# Altium project battery_protect.PrjPcb
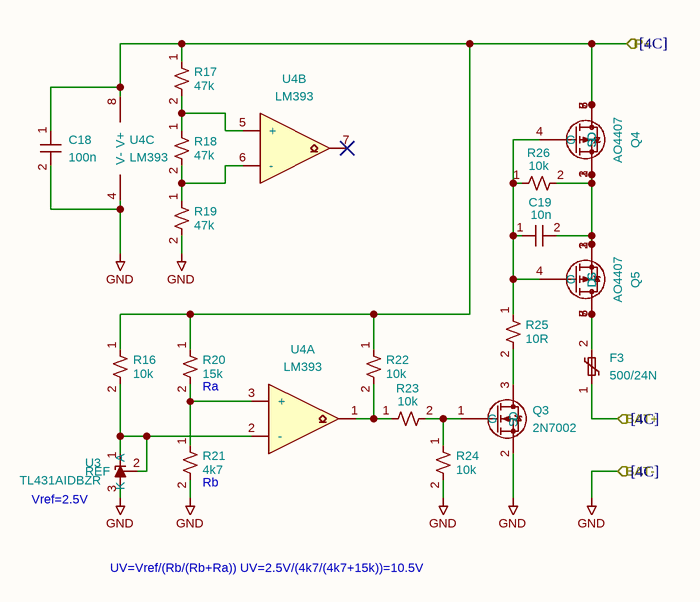
[diagram p0: battery_protect.SchDoc]
6 sheets, 69 parts. Net scope: flat (ports and power ports of the same name join across sheets).
Board files: ups_lead_acid_electgpl_v1.0.PcbDoc, ups_lead_acid_electgpl_v1.0(1).PcbDoc
Sheets:
  battery_protect.SchDoc
  buck.SchDoc
  bypass.SchDoc
  charge.SchDoc
  input_protect.SchDoc
  voltmeter.SchDoc

## Sheet battery_protect.SchDoc
size 297 x 209 mm

### Parts
C18  100n  [C_0603_1608Metric]
C19  10n  [C_0603_1608Metric]
F3  500/24N  [Fuse_2920_7451Metric]
Q3  2N7002  [SOT-23]
Q4  AO4407  [SOP-8_3.9x4.9mm_P1.27mm]
Q5  AO4407  [SOP-8_3.9x4.9mm_P1.27mm]
R16  10k  [R_0603_1608Metric]
R17  47k  [R_0603_1608Metric]
R18  47k  [R_0603_1608Metric]
R19  47k  [R_0603_1608Metric]
R20  15k  [R_0603_1608Metric]
R21  4k7  [R_0603_1608Metric]
R22  10k  [R_0603_1608Metric]
R23  10k  [R_0603_1608Metric]
R24  10k  [R_0603_1608Metric]
R25  10R  [R_0603_1608Metric]
R26  10k  [R_0603_1608Metric]
U3  TL431AIDBZR  [SOT-23]
U4  LM393  [SOIC-8_3.9x4.9mm_P1.27mm]  (parts A,B,C of 3)

### Ports
BAT+ (in, see [4C]), BAT- (in, see [4C]), P+ (in, see [4C])

### Nets
GND: C18.2 Q3.2(S) R19.2 R21.2 R24.2 U3.3(A) U4.4(V-) ; port BAT-
BAT+: F3.1 ; port BAT+
P+: C18.1 Q4.5(D) Q4.6(D) Q4.7(D) Q4.8(D) R16.1 R17.1 R20.1 R22.1 U4.8(V+) ; port P+
NetC19_1: C19.1 Q4.4(G) Q5.4(G) R25.1 R26.1
NetC19_2: C19.2 Q4.1(S) Q4.2(S) Q4.3(S) Q5.1(S) Q5.2(S) Q5.3(S) R26.2
NetF3_2: F3.2 Q5.5(D) Q5.6(D) Q5.7(D) Q5.8(D)
NetQ3_1: Q3.1(G) R23.2 R24.1
NetQ3_3: Q3.3(D) R25.2
NetR16_2: R16.2 U3.1(K) U3.2(REF) U4.2(-)
NetR17_2: R17.2 R18.1 U4.5(+)
NetR18_2: R18.2 R19.1 U4.6(-)
NetR20_2: R20.2 R21.1 U4.3(+)
NetR22_2: R22.2 R23.1 U4.1

Not connected (* = marked no-connect by the designer): U4 7*

### Notes on the sheet
- (near R20) Ra
- (near R21) Rb
- (near U3) Vref=2.5V
- UV=Vref/(Rb/(Rb+Ra))
  UV=2.5V/(4k7/(4k7+15k))=10.5V
- 1
- 2
- 3
- 4
- 5
- 6
- A
- B
- C
- D
- Title: UPS Lead Acid
- File: battery_protect.kicad_sch
- Sheet: /
- Electgpl
- KiCad E.D.A.  kicad (5.1.4)-1
- Size: A4
- Date: 2025-06-05
- Rev: 1.0
- Id: 1/1

### Library data of the parts
C18 = C_Small: MFR P/N: CL10B104KB8NNNC; LCSC: C1591; Value: 100n; Footprint: Capacitor_SMD:C_0603_1608Metric
C19 = C_Small: MFR P/N: CL10B103KB8NNNC; LCSC: C1589; Value: 10n; Footprint: Capacitor_SMD:C_0603_1608Metric
F3 = Polyfuse_Small: MFR P/N: SMD2920-500/24N; Absolute minimum: 16V 3A; Reference MFG P/N: C6165172; LCSC: C6165172; Value: 500/24N; Footprint: Fuse:Fuse_2920_7451Metric
Q3 = 2N7002: MFR P/N: 2N7002,215; LCSC: C65189; Value: 2N7002; Footprint: Package_TO_SOT_SMD:SOT-23
Q4 Q5 = IRF7404: MFR P/N: AO4407A; LCSC: C2841482; Value: AO4407; Footprint: Package_SO:SOP-8_3.9x4.9mm_P1.27mm
R16 R22-R24 R26 = R_Small_US: MFR P/N: FRC0603J103 TS; LCSC: C2930027; Value: 10k; Footprint: Resistor_SMD:R_0603_1608Metric
R17-R19 = R_Small_US: MFR P/N: FRC0603F4702TS; LCSC: C2907042; Value: 47k; Footprint: Resistor_SMD:R_0603_1608Metric
R20 = R_Small_US: MFR P/N: FRC0603F1502TS; LCSC: C2906995; Value: 15k; Footprint: Resistor_SMD:R_0603_1608Metric
R21 = R_Small_US: MFR P/N: FRC0603J472 TS; LCSC: C2907166; Value: 4k7; Footprint: Resistor_SMD:R_0603_1608Metric
R25 = R_Small_US: MFR P/N: FRC0603J100 TS; LCSC: C2907091; Value: 10R; Footprint: Resistor_SMD:R_0603_1608Metric
U3 = TL431DBZ: LCSC: C23892; MFR P/N: TL431AIDBZR; Value: TL431AIDBZR; Footprint: Package_TO_SOT_SMD:SOT-23
U4 = LM393: MFR P/N: LM393DR; LCSC: C67470; Value: LM393; Footprint: Package_SO:SOIC-8_3.9x4.9mm_P1.27mm

## Sheet buck.SchDoc
size 297 x 209 mm
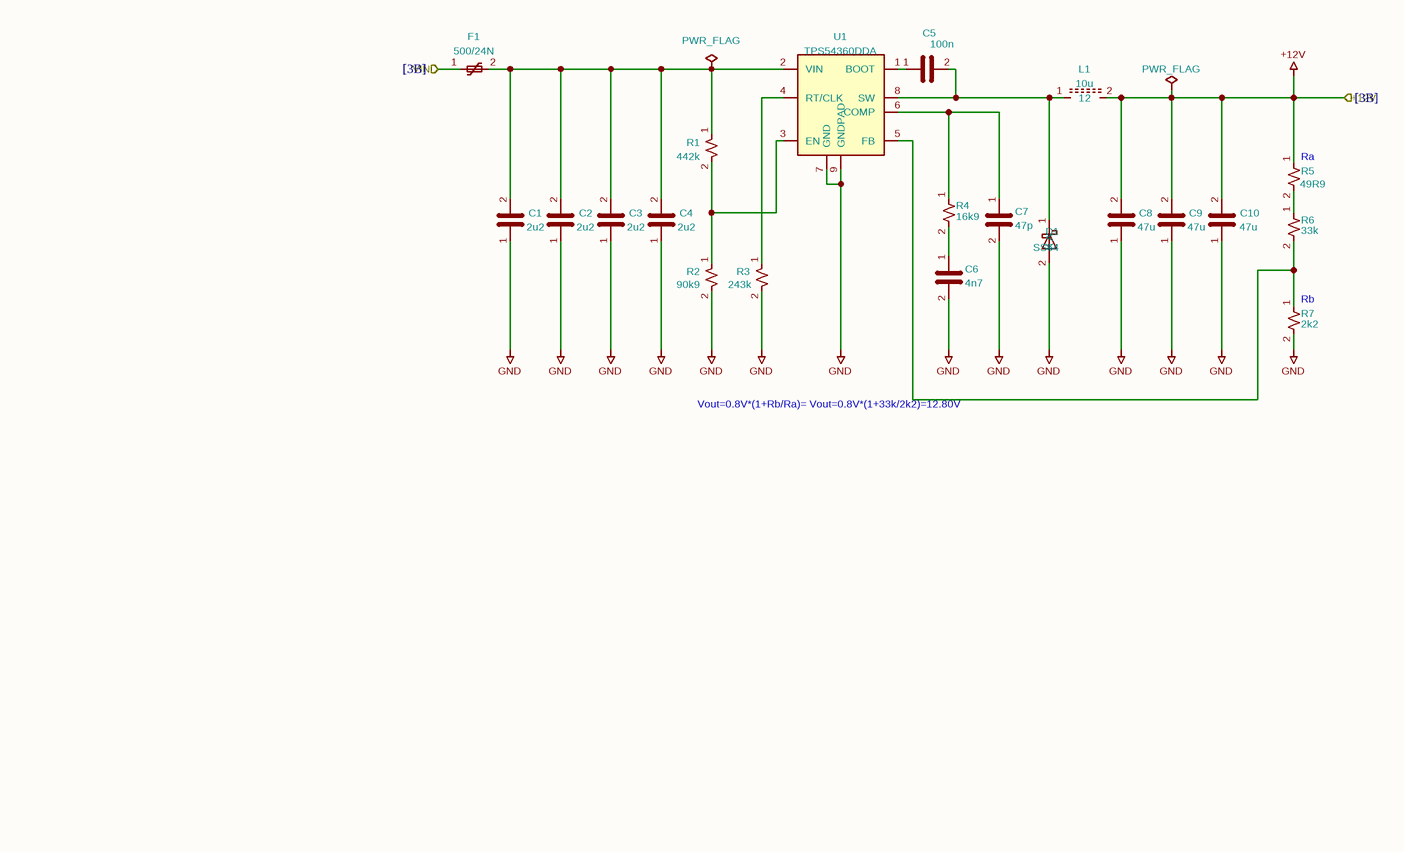
[diagram p1: buck.SchDoc]

### Parts
#FLG01  PWR_FLAG  (graphical)
#FLG02  PWR_FLAG  (graphical)
C1  2u2  [C_0603_1608Metric]
C2  2u2  [C_0603_1608Metric]
C3  2u2  [C_0603_1608Metric]
C4  2u2  [C_0603_1608Metric]
C5  100n  [C_0603_1608Metric]
C6  4n7  [C_0603_1608Metric]
C7  47p  [C_0603_1608Metric]
C8  47u  [C_0805_2012Metric]
C9  47u  [C_0805_2012Metric]
C10  47u  [C_0805_2012Metric]
D1  SS54  [D_SMC]
F1  500/24N  [Fuse_2920_7451Metric]
L1  10u  [L_Taiyo-Yuden_NR-60xx]
R1  442k  [R_0603_1608Metric]
R2  90k9  [R_0603_1608Metric]
R3  243k  [R_0603_1608Metric]
R4  16k9  [R_0603_1608Metric]
R5  49R9  [R_0603_1608Metric]
R6  33k  [R_0603_1608Metric]
R7  2k2  [R_0603_1608Metric]
U1  TPS54360DDA  [HSOP-8-1EP_3.9x4.9mm_P1.27mm_EP2.41x3.1mm_ThermalVias]

### Ports
+12V (in, see [3B]), VIN (in, see [3B])

### Nets
+12V: #FLG02.1 C8.2 C9.2 C10.2 L1.2 R5.1 ; port +12V
GND: C1.1 C2.1 C3.1 C4.1 C6.2 C7.2 C8.1 C9.1 C10.1 D1.2(A) R2.2 R3.2 R7.2 U1.7(GND) U1.9(GNDPAD)
VIN: F1.1 ; port VIN
Net#FLG01_1: #FLG01.1 C1.2 C2.2 C3.2 C4.2 F1.2 R1.1 U1.2(VIN)
NetC5_1: C5.1 U1.1(BOOT)
NetC5_2: C5.2 D1.1(K) L1.1 U1.8(SW)
NetC6_1: C6.1 R4.2
NetC7_1: C7.1 R4.1 U1.6(COMP)
NetR1_2: R1.2 R2.1 U1.3(EN)
NetR3_1: R3.1 U1.4(RT/CLK)
NetR5_2: R5.2 R6.1
NetR6_2: R6.2 R7.1 U1.5(FB)

### Notes on the sheet
- (near R5) Ra
- (near R7) Rb
- Vout=0.8V*(1+Rb/Ra)=
  Vout=0.8V*(1+33k/2k2)=12.80V
- 1
- 2
- 3
- 4
- 5
- 6
- A
- B
- C
- D
- Title: UPS Lead Acid
- File: buck.kicad_sch
- Sheet: /
- Electgpl
- KiCad E.D.A.  kicad (5.1.4)-1
- Size: A4
- Date: 2025-06-05
- Rev: 1.0
- Id: 1/1

### Library data of the parts
C1-C4 = C: MFR P/N: CL10A225KB8NNNC; Absolute minimum: 100V; Reference MFG P/N: C6119935; LCSC: C913904; Value: 2u2; Footprint: Capacitor_SMD:C_0603_1608Metric
C5 = C: MFR P/N: CL10B104KB8NNNC; Absolute minimum: 50V; Reference MFG P/N: C5142567; LCSC: C1591; Value: 100n; Footprint: Capacitor_SMD:C_0603_1608Metric
C6 = C: MFR P/N: CL10B472KB8NNNC; Absolute minimum: 50V; Reference MFG P/N: C7503510; LCSC: C1621; Value: 4n7; Footprint: Capacitor_SMD:C_0603_1608Metric
C7 = C: MFR P/N: CL10C470JB8NNNC; Absolute minimum: 50V; Reference MFG P/N: C466230; LCSC: C1671; Value: 47p; Footprint: Capacitor_SMD:C_0603_1608Metric
C8-C10 = C: MFR P/N: CL21A226MAYNNNE; Absolute minimum: 10V; Reference MFG P/N: C19103846; LCSC: C602037; Value: 47u; Footprint: Capacitor_SMD:C_0805_2012Metric
D1 = B240: Absolute minimum: 40V 5A; Reference MFG P/N: C5200096; LCSC: C5199108; MFR P/N: SS54; Value: SS54; Footprint: Diode_SMD:D_SMC
F1 = Polyfuse_Small: as F3 on sheet battery_protect; LCSC: C6165172; Value: 500/24N; Footprint: Fuse:Fuse_2920_7451Metric
L1 = L_Ferrite: MFR P/N: VLS6045EX-100M; Absolute minimum: 5A; Reference MFG P/N: C2849537; LCSC: C360734; Value: 10u; Footprint: Inductor_SMD:L_Taiyo-Yuden_NR-60xx
R1 = R_Small_US: MFR P/N: 0603WAF4423T5E; Absolute minimum: 442k 0402; Reference MFG P/N: C3016035; LCSC: C23175; Value: 442k; Footprint: Resistor_SMD:R_0603_1608Metric
R2 = R_Small_US: MFR P/N: FRC0603F9092TS; Absolute minimum: 90k9 0402; Reference MFG P/N: C26989; LCSC: C2930136; Value: 90k9; Footprint: Resistor_SMD:R_0603_1608Metric
R3 = R_Small_US: MFR P/N: FRC0603F2433TS; Absolute minimum: 243k 0402; Reference MFG P/N: C2998149; LCSC: C7467321; Value: 243k; Footprint: Resistor_SMD:R_0603_1608Metric
R4 = R_Small_US: MFR P/N: FRC0603F1692TS; Absolute minimum: 16k9 0402; Reference MFG P/N: C2929989; LCSC: C2933158; Value: 16k9; Footprint: Resistor_SMD:R_0603_1608Metric
R5 = R_Small_US: MFR P/N: FRC0603F49R9TS; Absolute minimum: 49R9 0402; Reference MFG P/N: C25120; LCSC: C2930110; Value: 49R9; Footprint: Resistor_SMD:R_0603_1608Metric
R6 = R_Small_US: MFR P/N: FRC0603J333 TS; Absolute minimum: 53k6 0402; Reference MFG P/N: C5153961; LCSC: C2907153; Value: 33k; Footprint: Resistor_SMD:R_0603_1608Metric
R7 = R_Small_US: MFR P/N: FRC0603J222 TS; Absolute minimum: 10k2 0402; Reference MFG P/N: C3015976; LCSC: C2907117; Value: 2k2; Footprint: Resistor_SMD:R_0603_1608Metric
U1 = TPS54360DDA: MFR P/N: TPS54360DDAR; Reference MFG P/N: C44377; Absolute minimum: TPS54360DDA; LCSC: C44377; Value: TPS54360DDA; Footprint: Package_SO:HSOP-8-1EP_3.9x4.9mm_P1.27mm_EP2.41x3.1mm_ThermalVias
#FLG01 #FLG02 = PWR_FLAG: Value: PWR_FLAG

## Sheet bypass.SchDoc
size 297 x 209 mm
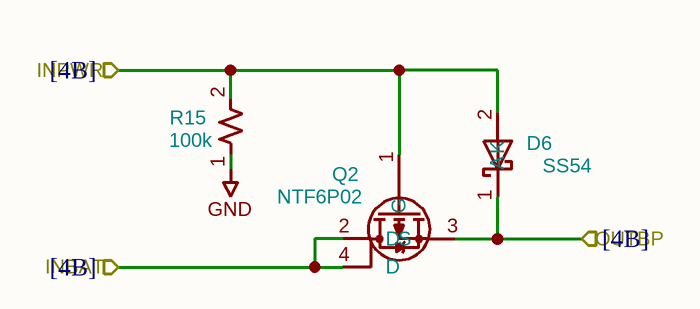
[diagram p2: bypass.SchDoc]

### Parts
D6  SS54  [D_SMC]
Q2  NTF6P02  [SOT-223-3_TabPin2]
R15  100k  [R_0603_1608Metric]

### Ports
INBAT (in, see [4B]), INPWR (in, see [4B]), OUTBP (in, see [4B])

### Nets
GND: R15.1
INBAT: Q2.2(D) Q2.4(D) ; port INBAT
INPWR: D6.2(A) Q2.1(G) R15.2 ; port INPWR
OUTBP: D6.1(K) Q2.3(S) ; port OUTBP

### Notes on the sheet
- 1
- 2
- 3
- 4
- 5
- 6
- A
- B
- C
- D
- Title: UPS Lead Acid
- File: bypass.kicad_sch
- Sheet: /
- Electgpl
- KiCad E.D.A.  kicad (5.1.4)-1
- Size: A4
- Date: 2025-06-05
- Rev: 1.0
- Id: 1/1

### Library data of the parts
D6 = B240: as D1 on sheet buck; LCSC: C5199108; MFR P/N: SS54; Value: SS54; Footprint: Diode_SMD:D_SMC
Q2 = Q_PMOS_GDSD: MFR P/N: NTF6P02T3G-VB; LCSC Part: C154901; LCSC: C558214; Value: NTF6P02; Footprint: Package_TO_SOT_SMD:SOT-223-3_TabPin2
R15 = R_Small_US: MFR P/N: FRC0603J104 TS; LCSC Part: C99198; LCSC: C2907088; Value: 100k; Footprint: Resistor_SMD:R_0603_1608Metric

## Sheet charge.SchDoc
size 297 x 209 mm
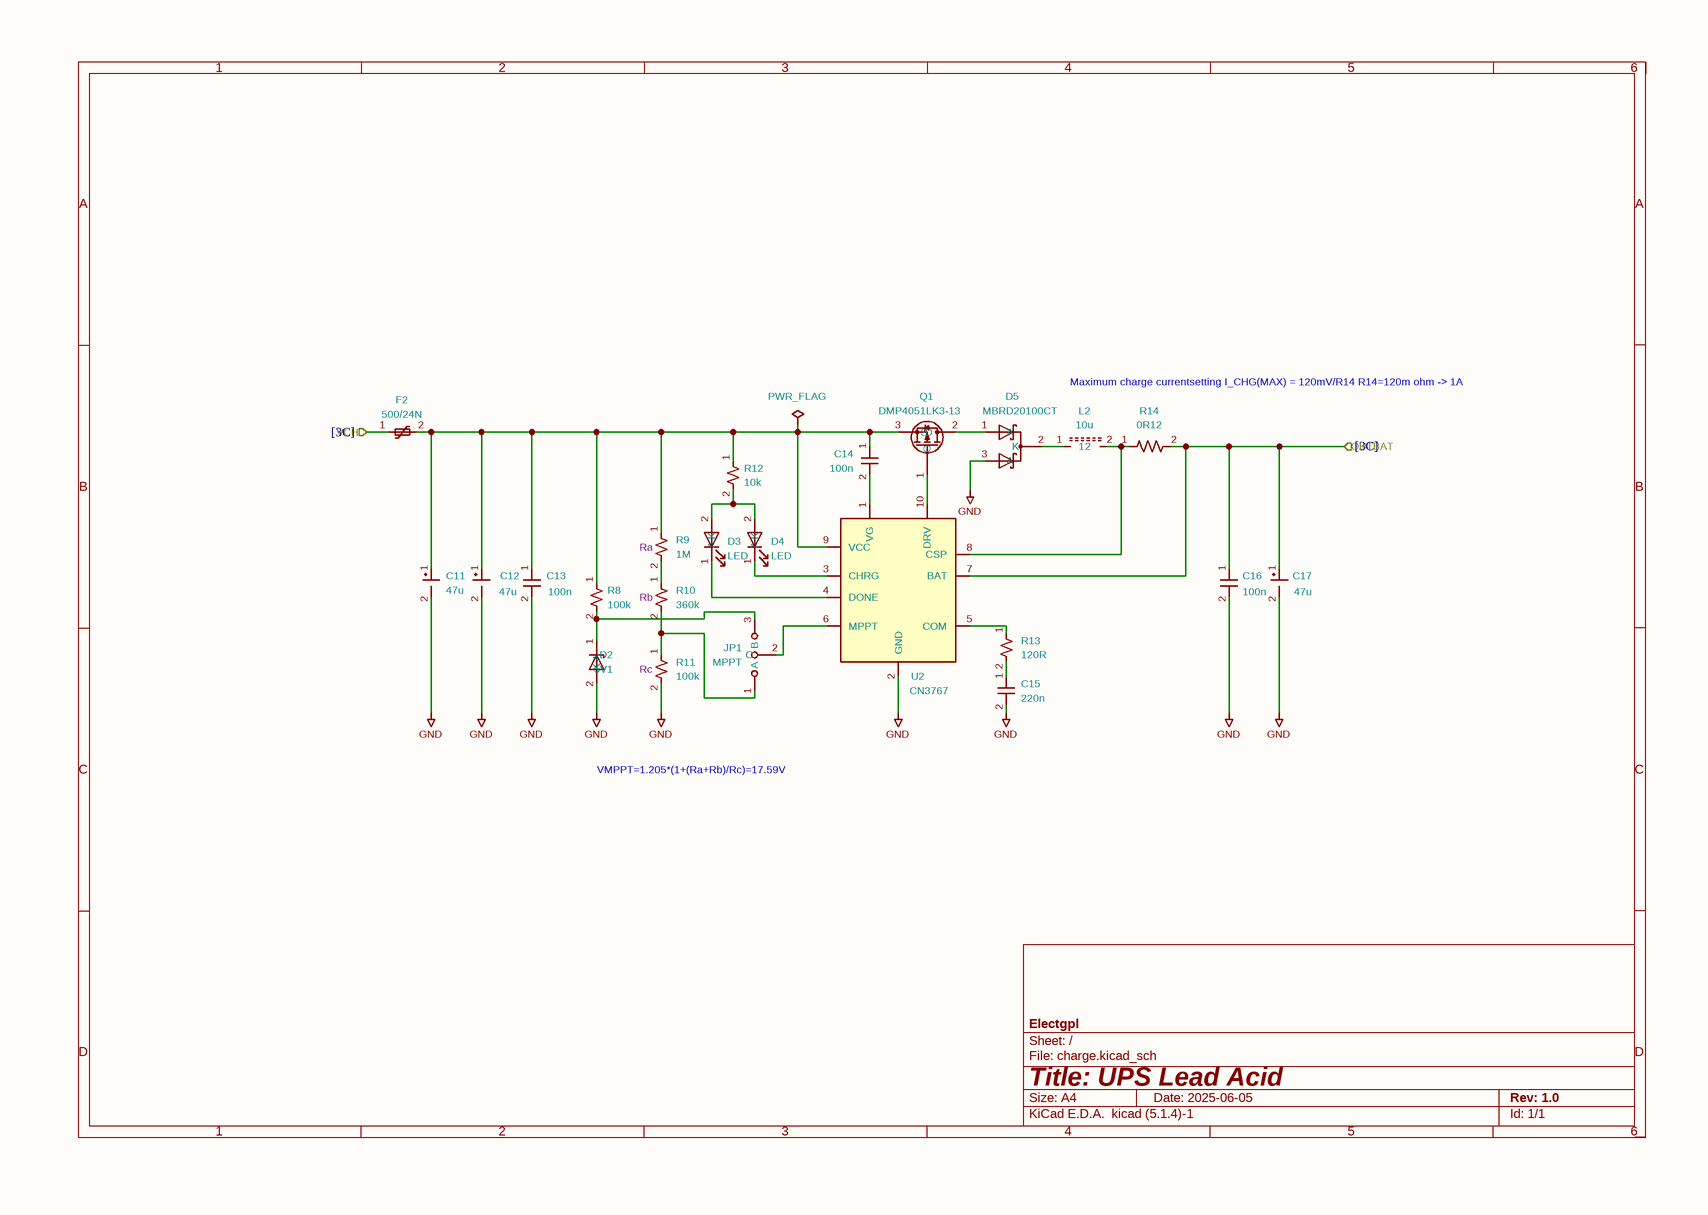
[diagram p3: charge.SchDoc]

### Parts
#FLG03  PWR_FLAG  (graphical)
C11  47u  [C_0805_2012Metric]
C12  47u  [C_0805_2012Metric]
C13  100n  [C_0603_1608Metric]
C14  100n  [C_0603_1608Metric]
C15  220n  [C_0603_1608Metric]
C16  100n  [C_0603_1608Metric]
C17  47u  [C_0805_2012Metric]
D2  5V1  [D_SOD-123]
D3  LED  [LED_0603_1608Metric]
D4  LED  [LED_0603_1608Metric]
D5  MBRD20100CT  [TO-252-2]
F2  500/24N  [Fuse_2920_7451Metric]
JP1  MPPT  [SolderJumper-3_P1.3mm_Open_Pad1.0x1.5mm]
L2  10u  [L_Taiyo-Yuden_NR-60xx]
Q1  DMP4051LK3-13  [TO-252-2]
R8  100k  [R_0603_1608Metric]
R9  Aux: Ra  [R_0603_1608Metric]  (hidden comment: 1M)
R10  Aux: Rb  [R_0603_1608Metric]  (hidden comment: 360k)
R11  Aux: Rc  [R_0603_1608Metric]  (hidden comment: 100k)
R12  10k  [R_0603_1608Metric]
R13  120R  [R_0603_1608Metric]
R14  0R12  [R_2512_6332Metric]
U2  CN3767  [SSOP-10_3.9x4.9mm_P1.00mm]

### Ports
OUTBAT (in, see [3C]), VCH (in, see [3C])

### Nets
GND: C11.2 C12.2 C13.2 C15.2 C16.2 C17.2 D2.2(A) D5.3(A) R11.2 U2.2(GND)
OUTBAT: C16.1 C17.1 R14.2 U2.7(BAT) ; port OUTBAT
VCH: F2.1 ; port VCH
Net#FLG03_1: #FLG03.1 C11.1 C12.1 C13.1 C14.1 F2.2 Q1.3(S) R8.1 R9.1 R12.1 U2.9(VCC)
NetC14_2: C14.2 U2.1(VG)
NetC15_1: C15.1 R13.2
NetD2_1: D2.1(K) JP1.3(B) R8.2
NetD3_1: D3.1(K) U2.4(DONE)
NetD3_2: D3.2(A) D4.2(A) R12.2
NetD4_1: D4.1(K) U2.3(CHRG)
NetD5_1: D5.1(A) Q1.2(D)
NetD5_2: D5.2(K) L2.1
NetJP1_1: JP1.1(A) R10.2 R11.1
NetJP1_2: JP1.2(C) U2.6(MPPT)
NetL2_2: L2.2 R14.1 U2.8(CSP)
NetQ1_1: Q1.1(G) U2.10(DRV)
NetR9_2: R9.2 R10.1
NetR13_1: R13.1 U2.5(COM)

### Notes on the sheet
- Maximum charge currentsetting
  I_CHG(MAX) = 120mV/R14
  R14=120m ohm -> 1A
- VMPPT=1.205*(1+(Ra+Rb)/Rc)=17.59V
- 1
- 2
- 3
- 4
- 5
- 6
- A
- B
- C
- D
- Title: UPS Lead Acid
- File: charge.kicad_sch
- Sheet: /
- Electgpl
- KiCad E.D.A.  kicad (5.1.4)-1
- Size: A4
- Date: 2025-06-05
- Rev: 1.0
- Id: 1/1

### Library data of the parts
C11 C12 C17 = C_Polarized_Small_US: MFR P/N: CL21A226MAYNNNE; Internal P/N: C47U-25-5_5.4; LCSC: C602037; Value: 47u; Footprint: Capacitor_SMD:C_0805_2012Metric
C13 C14 C16 = C_Small: MFR P/N: CL10B104KB8NNNC; Internal P/N: C100N-50-0603; LCSC: C1591; Value: 100n; Footprint: Capacitor_SMD:C_0603_1608Metric
C15 = C_Small: MFR P/N: CL10B224KB8NNNC; Internal P/N: C220N-50-0603; LCSC: C64705; Value: 220n; Footprint: Capacitor_SMD:C_0603_1608Metric
D2 = D_Zener: MFR P/N: MMSZ5231BT1G; Internal P/N: DZ-5.1; LCSC: C66198; Value: 5V1; Footprint: Diode_SMD:D_SOD-123
D3 = LED: MFR P/N: XL-1608UYC-06; Internal P/N: DL-GREEN-0603; LCSC: C965802; Value: LED; Footprint: LED_SMD:LED_0603_1608Metric
D4 = LED: MFR P/N: XL-1608UYC-06; Internal P/N: DL-RED-0603; LCSC: C965802; Value: LED; Footprint: LED_SMD:LED_0603_1608Metric
D5 = D_Schottky_Dual_CommonCathode_AKA_Parallel: MFR P/N: MBRD20100CT-13; LCSC: C460890; Value: MBRD20100CT; Footprint: Package_TO_SOT_SMD:TO-252-2
F2 = Polyfuse_Small: as F3 on sheet battery_protect; LCSC: C6165172; Value: 500/24N; Footprint: Fuse:Fuse_2920_7451Metric
JP1 = Jumper_3_Bridged12: Value: MPPT; Footprint: Jumper:SolderJumper-3_P1.3mm_Open_Pad1.0x1.5mm
L2 = L_Ferrite: MFR P/N: VLS6045EX-100M; Internal P/N: L10U-10-12_12_6; LCSC: C360734; Value: 10u; Footprint: Inductor_SMD:L_Taiyo-Yuden_NR-60xx
Q1 = QM6015D: LCSC: C397952; MFR P/N: DMP4051LK3-13; Value: DMP4051LK3-13; Footprint: Package_TO_SOT_SMD:TO-252-2
R8 R11 = R_Small_US: MFR P/N: FRC0603J104 TS; Internal P/N: R100K-0603-1; LCSC: C2907088; Value: 100k; Footprint: Resistor_SMD:R_0603_1608Metric
R9 = R_Small_US: MFR P/N: FRC0603F1004TS; Internal P/N: R1M-0603-1; LCSC: C2907003; Value: 1M; Footprint: Resistor_SMD:R_0603_1608Metric
R10 = R_Small_US: MFR P/N: FRC0603F3603TS; Internal P/N: R360K-0603-1; LCSC: C2907029; Value: 360k; Footprint: Resistor_SMD:R_0603_1608Metric
R12 = R_Small_US: MFR P/N: FRC0603J103 TS; Internal P/N: R10K-0603-1; LCSC: C2930027; Value: 10k; Footprint: Resistor_SMD:R_0603_1608Metric
R13 = R_Small_US: MFR P/N: FRC0603J121 TS; Internal P/N: R120-0603-1; LCSC: C2907096; Value: 120R; Footprint: Resistor_SMD:R_0603_1608Metric
R14 = R_US: MFR P/N: PT2512FK-7W0R12L; Internal P/N: R0.03-2512_2W-1; LCSC: C875871; Value: 0R12; Footprint: Resistor_SMD:R_2512_6332Metric
#FLG03 = PWR_FLAG: Value: PWR_FLAG
U2 = CN3767: MFR P/N: CN3767; LCSC: C81968; Value: CN3767; Footprint: Package_SO:SSOP-10_3.9x4.9mm_P1.00mm

## Sheet input_protect.SchDoc
size 297 x 209 mm
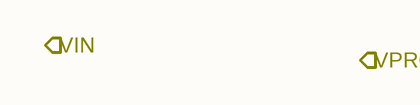
[diagram p4: input_protect.SchDoc]

### Ports
VIN (in), VPROT (in)

### Notes on the sheet
- 1
- 2
- 3
- 4
- 5
- 6
- A
- B
- C
- D
- Title: UPS Lead Acid
- File: input_protect.kicad_sch
- Sheet: /
- Electgpl
- KiCad E.D.A.  kicad (5.1.4)-1
- Size: A4
- Date: 2025-06-05
- Rev: 1.0
- Id: 1/1

## Sheet voltmeter.SchDoc
size 297 x 209 mm
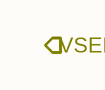
[diagram p5: voltmeter.SchDoc]

### Ports
VSENSE (in)

### Notes on the sheet
- 1
- 2
- 3
- 4
- 5
- 6
- A
- B
- C
- D
- Title: UPS Lead Acid
- File: voltmeter.kicad_sch
- Sheet: /
- Electgpl
- KiCad E.D.A.  kicad (5.1.4)-1
- Size: A4
- Date: 2025-06-05
- Rev: 1.0
- Id: 1/1

## Nets that join several sheets
GND: battery_protect (7 pins), buck (15 pins), bypass (R15.1), charge (10 pins)